# EAGLE schematic power supply (EAGLE 6.1)
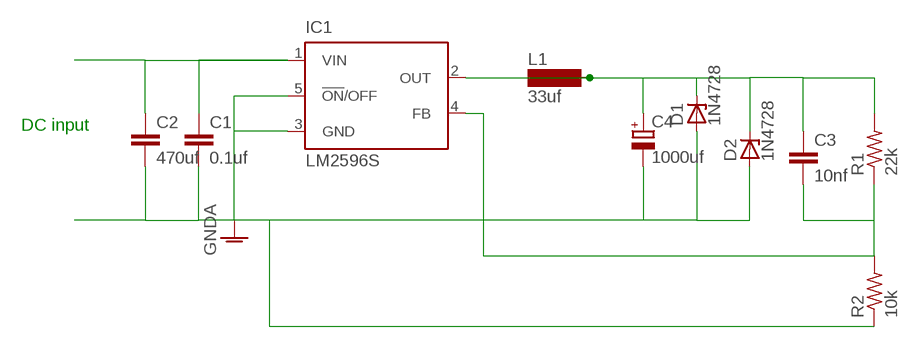
[diagram p0: schematic, sheet 1]

## Parts
C1  0.1uf  C2,5-3  [C2.5-3]
C2  470uf  C2,5-3  [C2.5-3]
C3  10nf  C2,5-3  [C2.5-3]
C4  1000uf  CPOL-EU085CS-1AR  [085CS_1AR]
D1  1N4728  [DO41Z10]
D2  1N4728  [DO41Z10]
IC1  LM2596S  [TO263-5]
L1  33uf  BS11  [BS11]
R1  22k  R-US_0204/2V  [0204V]
R2  10k  R-US_0204/2V  [0204V]

## Nets
GNDA: C1.2 C2.2 C4.- D1.A D2.A IC1.3(GND) IC1.5(!ON!/OFF) R2.1
N$1: C3.1 C4.+ D1.C D2.C IC1.2(OUT) L1.1 L1.2 R1.2
N$2: C1.1 C2.1 IC1.1(VIN)
N$3: C3.2 IC1.4(FB) R1.1 R2.2

## Notes on the sheet
- DC input

## Library data of the parts
C1-C3 = capacitor-wima:C: CAPACITOR naming: grid - package width
C4 = rcl:CPOL-EU: POLARIZED CAPACITOR, European symbol
D1 D2 = diode:1N4728: Z DIODE 3.3 V, 1W, 5 percent
IC1 = national-semiconductor (1):LM2596: SIMPLE SWITCHER® Power Converter 150 kHz 3A Step-Down Voltage Regulator Source: http://www.national.com/ds/LM/LM2596.pdf; MF: NATIONAL SEMICONDUCTOR; MPN: LM2596S-ADJ/NOPB; OC_FARNELL: 9494367; OC_NEWARK: 41K3842
L1 = inductor-neosid:BS: INDUCTOR nominal inductance, magnetically screened; OC_FARNELL: unknown; OC_NEWARK: unknown
R1 R2 = rcl:R-US_: RESISTOR, American symbol